# EAGLE design OnOnfre_DevBoard (EAGLE 9.1.3)
CNAME: BH ONOFRE; CREVISION: 5.1; DESIGNER: BrunoHorta
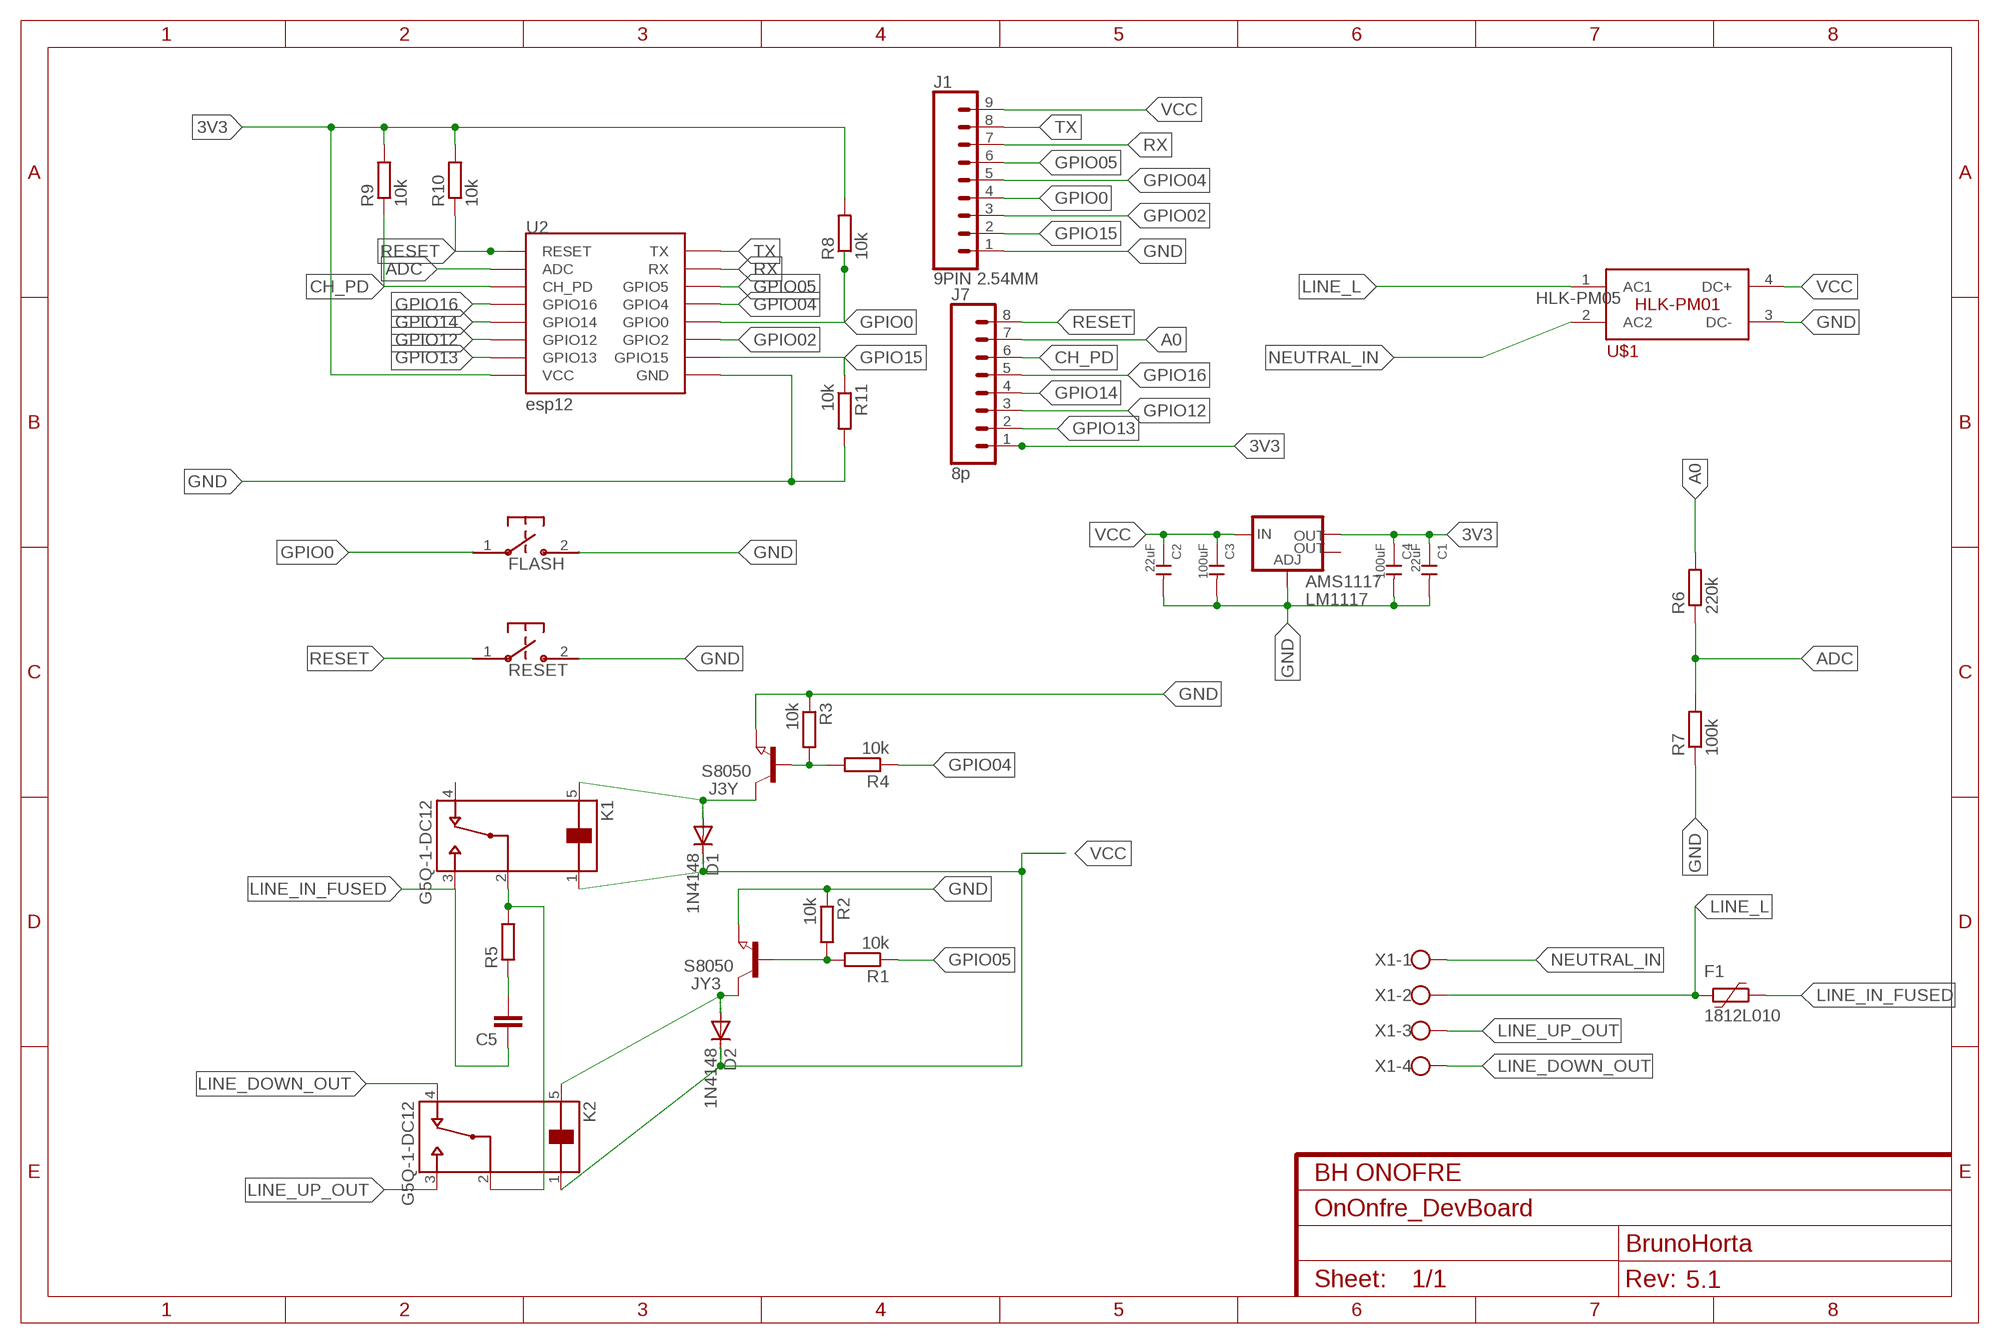
[diagram p0: schematic, sheet 1]

## Parts
AMS1117  LM1117  V_REG_LM1117SOT223  [SOT223]
C1  22uF  CERAMIC-1NF-1KV-10%-X7R(1206)  [C1206]
C2  22uF  CERAMIC-1NF-1KV-10%-X7R(1206)  [C1206]
C3  100uF  CERAMIC-1NF-1KV-10%-X7R(1206)  [C1206]
C4  100uF  CERAMIC-1NF-1KV-10%-X7R(1206)  [C1206]
C5  C-EU102-043X133  [C102-043X133]
D1  1N4148  DIODE-SOD80C  [SOD80C]
D2  1N4148  DIODE-SOD80C  [SOD80C]
F1  1812L010  [1812L]
FLASH  B3U-1000P-2P-SMD  B3U-1000P  [B3U-1000P]
J1  9PIN 2.54MM  CONN_09  [1X09]
J3Y  S8050  NPN-TRANSISTOR_SOT23  [SOT23]
J7  8p  CONN_08"  [1X08]
JY3  S8050  NPN-TRANSISTOR_SOT23  [SOT23]
K1  G5Q-1-DC12  [RELAY_G5Q-1-DC12]
K2  G5Q-1-DC12  [RELAY_G5Q-1-DC12]
R1  10k  R-EU_R0603  [R0603]
R2  10k  R-EU_R0603  [R0603]
R3  10k  R-EU_R0603  [R0603]
R4  10k  R-EU_R0603  [R0603]
R5  R-EU_R2512  [R2512]
R6  220k  R-EU_R0603  [R0603]
R7  100k  R-EU_R0603  [R0603]
R8  10k  R-EU_R0603  [R0603]
R9  10k  R-EU_R0603  [R0603]
R10  10k  R-EU_R0603  [R0603]
R11  10k  R-EU_R0603  [R0603]
RESET  B3U-1000P-2P-SMD  B3U-1000P  [B3U-1000P]
U2  esp12  ESP12SMD  [ESP12-SMD]
U$1  HLK-PM01  [HLK-PM01]
X1  W237-4  [W237-4]

## Nets
3V3: AMS1117.2(OUT) C1.1 C4.1 J7.1 R8.2 R9.2 R10.2 U2.VCC
A0: J7.7 R6.2
ADC: R6.1 R7.2 U2.ADC
CH_PD: J7.6 R9.1 U2.CH_PD
GND: AMS1117.1(ADJ) C1.2 C2.2 C3.2 C4.2 FLASH.2 J1.1 J3Y.2(E) JY3.2(E) R2.1 R3.1 R7.1 R11.2 RESET.2 U2.GND U$1.3(DC-)
GPIO0: FLASH.1 J1.4 R8.1 U2.GPIO0
GPIO02: J1.3 U2.GPIO2
GPIO04: J1.5 R4.1 U2.GPIO4
GPIO05: J1.6 R1.1 U2.GPIO5
GPIO12: J7.3 U2.GPIO12
GPIO13: J7.2 U2.GPIO13
GPIO14: J7.4 U2.GPIO14
GPIO15: J1.2 R11.1 U2.GPIO15
GPIO16: J7.5 U2.GPIO16
LINE_DOWN_OUT [220V]: K2.4 X1.4
LINE_IN_FUSED [220V]: C5.1 F1.1 K1.3
LINE_L [220V]: F1.2 U$1.1(AC1) X1.2
LINE_UP_OUT [220V]: K2.3 X1.3
N$1: D1.A J3Y.3(C) K1.5
N$3: K1.2 K2.2 R5.2
N$4: C5.2 R5.1
N$7: J3Y.1(B) R3.2 R4.2
N$9: D2.A JY3.3(C) K2.5
N$13: JY3.1(B) R1.2 R2.2
NEUTRAL_IN [220V]: U$1.2(AC2) X1.1
RESET: J7.8 R10.1 RESET.1 U2.RESET
RX: J1.7 U2.RXD0(RX)
TX: J1.8 U2.TXD0(TX)
VCC: AMS1117.3(IN) C2.1 C3.1 D1.C D2.C J1.9 K1.1 K2.1 U$1.4(DC+)
Unconnected: AMS1117.4(OUT) K1.4

## Notes on the sheet
- HLK-PM05

## Library data of the parts
AMS1117 = SparkFun-IC-Power:V_REG_LM1117: Voltage Regulator LM1117 Standard adjustable voltage regulator but in SMD form. Spark Fun Electronics SKU : COM-00595; PROD_ID: VREG-08170
C1-C4 = Seeed-Capacitor:CERAMIC-1NF-1KV-10%-X7R?(1206): 302010189; MPN: CC1206KKX7RCBB102; VALUE: 1NF
C5 = rcl:C-EU: CAPACITOR, European symbol; SPICEPREFIX: C
D1 D2 = diode:DIODE-: DIODE
F1 = polyfuse-smd_10:?: Polyfuse Resettable PTC Source: http://www.littelfuse.com/products/resettable-ptcs.aspx; MF: Littelfuse; MPN: 1812L010; OC_FARNELL: 1822210; OC_NEWARK: 78R5551
FLASH RESET = switches:B3U: Switch; DIGIKEY: SW1020CT-ND; MANUFACTURER: Omron; MPN: B3U-1000P
J1 = SparkFun-Connectors:CONN_09: Multi connection point. Often used as Generic Header-pin footprint for 0.1 inch spaced/style header connections On any of the 0.1 inch spaced packages, you can populate with these: Break Away Headers - Straight <https://www.sparkfun.com/products/116> (PRT-00116) Break Away Male Headers - Right Angle <https://www.sparkfun.com/products/553> (PRT-00553) Female Headers <https://www.sparkfun.com/products/115> (PRT-00115) Break Away Headers - Machine Pin <https://www.sparkfun.com/products/117> (PRT-00117) Break Away Female Headers - Swiss Machine Pin <https://www.sparkfun.com/products/743> (PRT-00743) For SCREWTERMINALS and SPRING TERMINALS visit here: Screw Terimnals on SparkFun.com <https://www.sparkfun.com/search/results?term=Screw+Terminals> (5mm/3.5mm/2.54mm spacing) This device is also useful as a general connection point to wire up your design to another part of your project. Our various solder wires solder well into these plated through hole pads. Hook-Up Wire - Assortment (Stranded, 22 AWG) <https://www.sparkfun.com/products/11375> (PRT-11375) Hook-Up Wire - Assortment (Solid Core, 22 AWG) <https://www.sparkfun.com/products/11367> (PRT-11367) View the entire wire category on our website here <https://www.sparkfun.com/categories/141> Special notes: Molex polarized connector foot print use with SKU : PRT-08231 with associated crimp pins and housings. 1MM SMD Version SKU: PRT-10208 NOTES ON THE VARIANTS LOCK and LOCK_LONGPADS... This footprint was designed to help hold the alignment of a through-hole component (i.e. 6-pin header) while soldering it into place. You may notice that each hole has been shifted either up or down by 0.005 of an inch from it's more standard position (which is a perfectly straight line). This slight alteration caused the pins (the squares in the middle) to touch the edges of the holes. Because they are alternating, it causes a "brace" to hold the component in place. 0.005 has proven to be the perfect amount of "off-center" position when using our standard breakaway headers. Although looks a little odd when you look at the bare footprint, once you have a header in there, the alteration is very hard to notice. Also,if you push a header all the way into place, it is covered up entirely on the bottom side.
J3Y JY3 = semicon-smd-ipc:NPN-TRANSISTOR_: NPN TRANSISTOR
J7 = SparkFun-Connectors:CONN_08: Multi connection point. Often used as Generic Header-pin footprint for 0.1 inch spaced/style header connections On any of the 0.1 inch spaced packages, you can populate with these: Break Away Headers - Straight <https://www.sparkfun.com/products/116> (PRT-00116) Break Away Male Headers - Right Angle <https://www.sparkfun.com/products/553> (PRT-00553) Female Headers <https://www.sparkfun.com/products/115> (PRT-00115) Break Away Headers - Machine Pin <https://www.sparkfun.com/products/117> (PRT-00117) Break Away Female Headers - Swiss Machine Pin <https://www.sparkfun.com/products/743> (PRT-00743) Arduino Stackable Header - 8 Pin <https://www.sparkfun.com/products/9279> (PRT-09279) For SCREWTERMINALS and SPRING TERMINALS visit here: Screw Terimnals on SparkFun.com <https://www.sparkfun.com/search/results?term=Screw+Terminals> (5mm/3.5mm/2.54mm spacing) This device is also useful as a general connection point to wire up your design to another part of your project. Our various solder wires solder well into these plated through hole pads. Hook-Up Wire - Assortment (Stranded, 22 AWG) <https://www.sparkfun.com/products/11375> (PRT-11375) Hook-Up Wire - Assortment (Solid Core, 22 AWG) <https://www.sparkfun.com/products/11367> (PRT-11367) View the entire wire category on our website here <https://www.sparkfun.com/categories/141> Special notes: Molex polarized connector foot print use with SKU : PRT-08231 with associated crimp pins and housings. 1MM SMD Version SKU: PRT-10208 NOTES ON THE VARIANTS LOCK and LOCK_LONGPADS... This footprint was designed to help hold the alignment of a through-hole component (i.e. 6-pin header) while soldering it into place. You may notice that each hole has been shifted either up or down by 0.005 of an inch from it's more standard position (which is a perfectly straight line). This slight alteration caused the pins (the squares in the middle) to touch the edges of the holes. Because they are alternating, it causes a "brace" to hold the component in place. 0.005 has proven to be the perfect amount of "off-center" position when using our standard breakaway headers. Although looks a little odd when you look at the bare footprint, once you have a header in there, the alteration is very hard to notice. Also,if you push a header all the way into place, it is covered up entirely on the bottom side.; PROD_ID: CONN-08438
K1 K2 = G5Q-1-DC12:G5Q-1-DC12: Power Relay 12VDC 5(NO)A/3(NC)DCA/10(NO)A/3(NC)ACA SPDT (( 20.3mm 10.3mm 16.2mm)) Through Hole; AVAILABILITY: Unavailable; DESCRIPTION: Power Relay 12VDC 5_NO_A/3_NC_DCA/10_NO_A/3_NC_ACA SPDT __ 20.3mm 10.3mm 16.2mm__ Through Hole; MF: Omron; MP: G5Q-1-DC12; PACKAGE: None; PRICE: None
R1-R11 = resistor:R-EU_: RESISTOR, European symbol
U2 = esp8266modules:ESP12: ESP8266 Wifi module 12
U$1 = HLK-PM01:HLK-PM01; AVAILABILITY: Unavailable; MF: Hi-link; MP: hlk-pm01; PACKAGE: Package Analog Devices; PRICE: None
X1 = con-wago-500:W237-4: WAGO SCREW CLAMP; OC_FARNELL: unknown; OC_NEWARK: unknown

## Net classes
1 220V: width 1.27 mm, clearance 2 mm

## Board
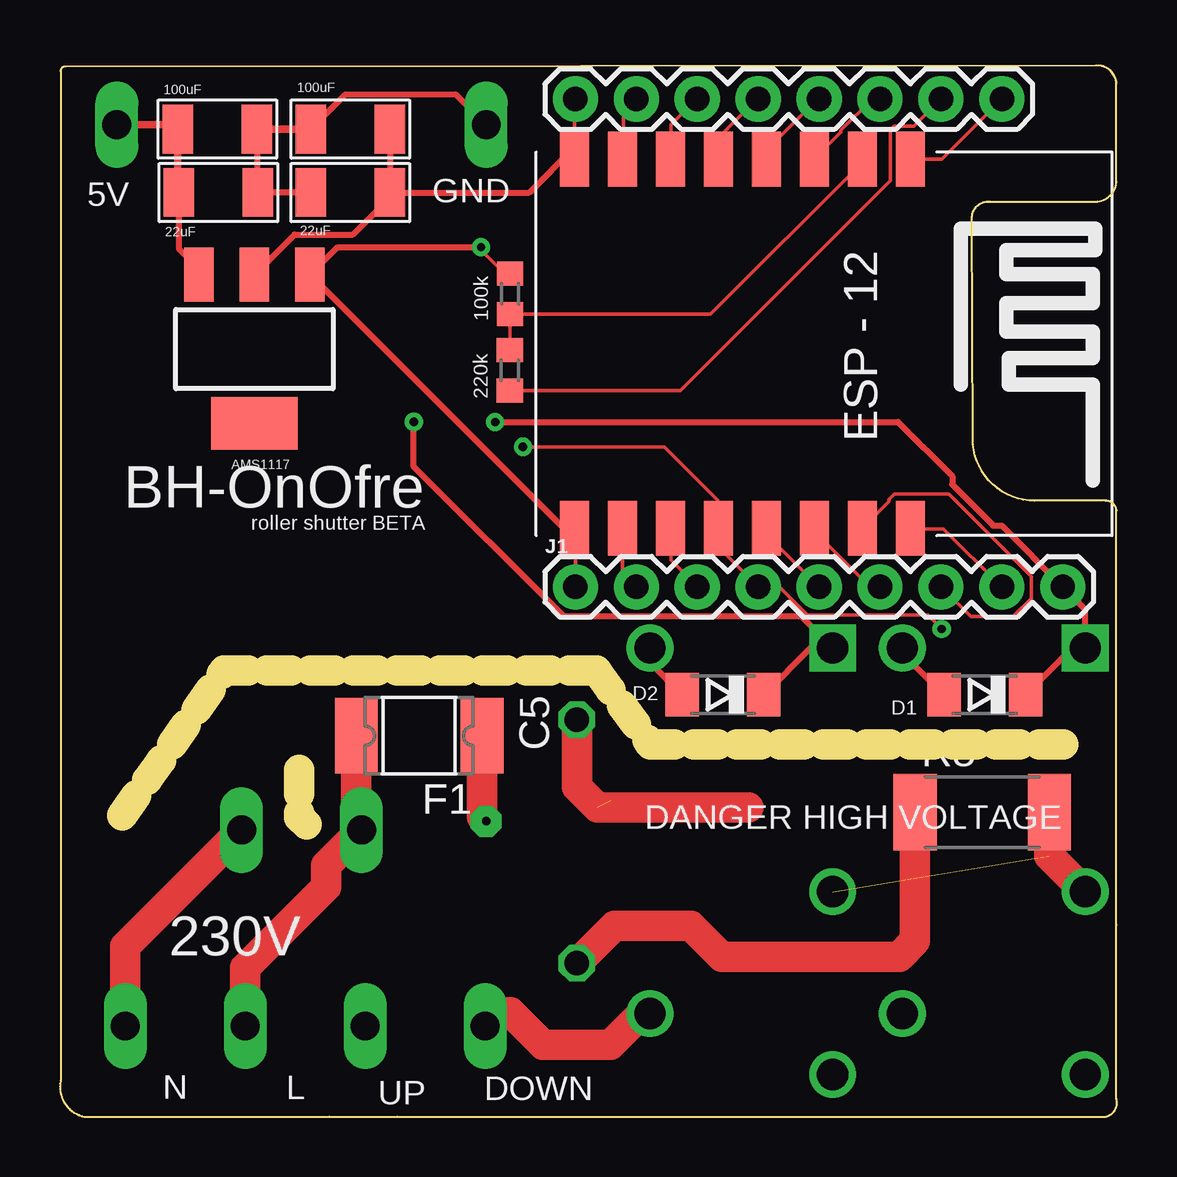
[diagram p1: board, top side]
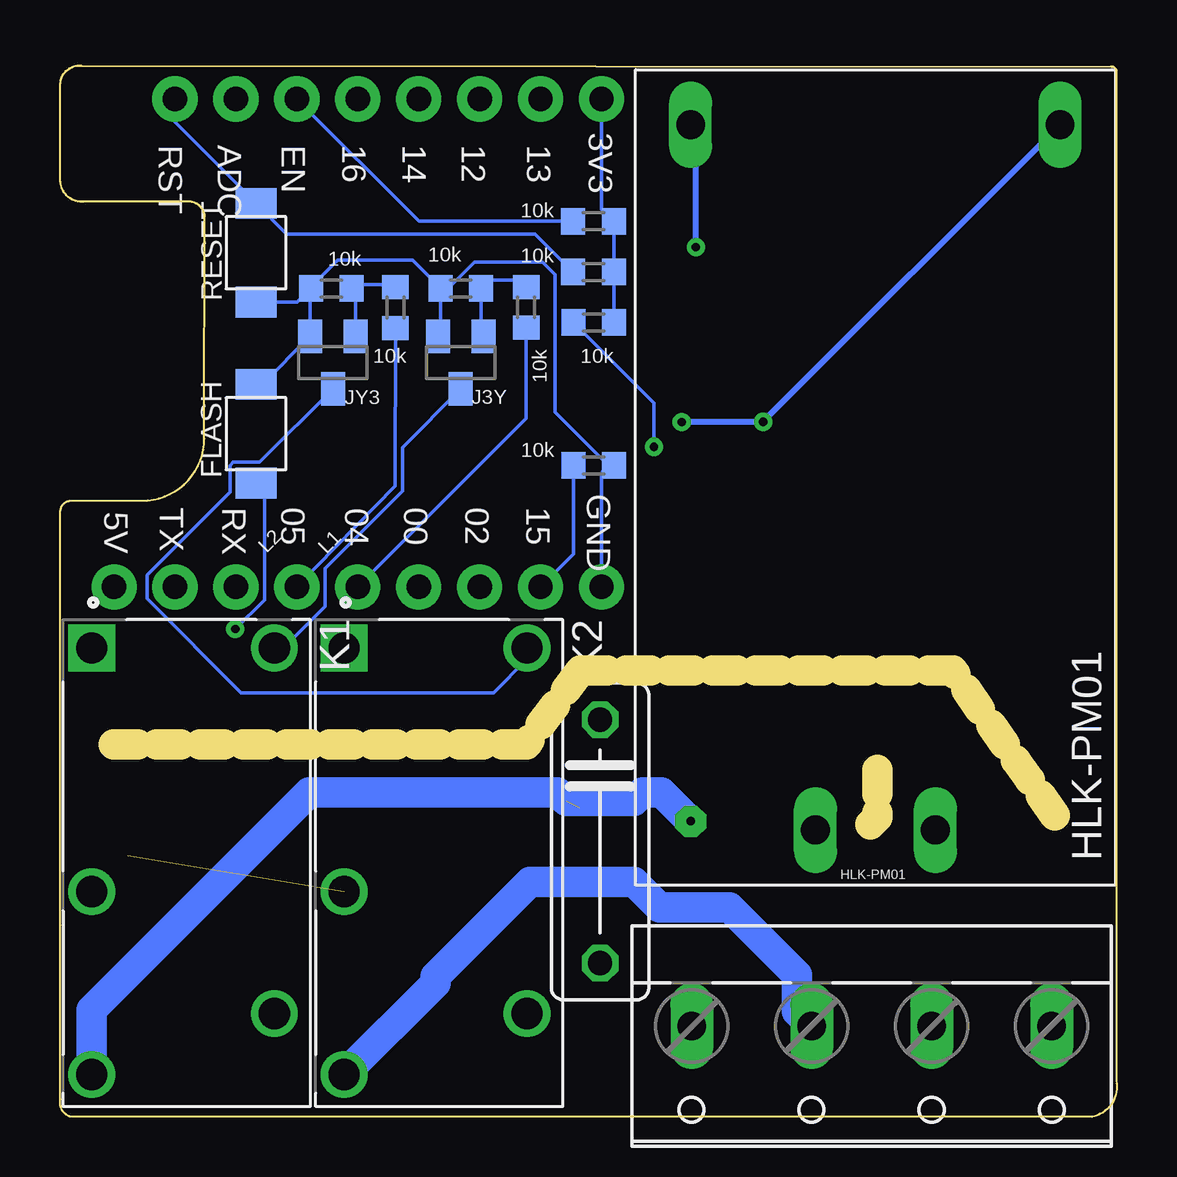
[diagram p2: board, bottom side, seen from below]

Size 44.06 x 43.82 mm. Coordinates in mm from the lower left corner, seen from the top.
Outline: 0.02,43.6 0.02,1.5 arc90 1.03,0 11.22,0 14.06,0.01 43.6,0 arc90 44.04,0.74 44.04,8 44.04,25.27 arc90 43.56,25.68 40.63,25.68 arc-90 38.04,28.27 38.02,37.53 arc-90 38.78,38.15 43.09,38.14 arc90 44.04,38.98 44.04,43.07 arc90 43.19,43.82 0.24,43.78 arc90 0.02,43.6
Copper layers (1*16): Top 0.035mm / dielectric 1.5mm / Bottom 0.035mm
Design rules "default": minimum track width 6mil, minimum drill 0.35mm, track to track 6mil, track to pad 6mil, pad to pad 6mil, via to via 6mil, smd to smd 6mil, copper to edge 40mil, drill to drill 6mil, minimum pad ring 10mil, minimum via ring 8mil, stop-mask expansion 4mil, vias tented up to drill 0mil, thermal gap 10mil
Milling: 30 lines

### Footprints (pad centres in the part's own frame; a part is rotated, then mirrored left to right if it is on the bottom)
SOT223 = smd 1.219 x 2.235: 1 -2.311,-3.099; 2 0,-3.099; 3 2.311,-3.099 | smd 3.6 x 2.2: 4 0,3.099
C1206 = smd 1.27 x 2.032: 1 -1.651,0; 2 1.651,0
C102-043X133 = drill 1.016 octagon: 1 -5.08,0; 2 5.08,0
SOD80C = smd 1.4 x 1.8: A 1.7,0; C -1.7,0
1812L = smd 1.78 x 3.15: 1 -2.62,0; 2 2.62,0
B3U-1000P = smd 1.283 x 1.7: 1 -2.056,0; 2 2.056,0
1X09 = drill 1.016 pad 1.88: 1 0,0; 2 2.54,0; 3 5.08,0; 4 7.62,0; 5 10.16,0; 6 12.7,0; 7 15.24,0; 8 17.78,0; 9 20.32,0
SOT23 = smd 1 x 1.4: 1 -0.95,-1.1; 2 0.95,-1.1; 3 0,1.1
1X08 = drill 1.016 pad 1.88: 1 0,0; 2 2.54,0; 3 5.08,0; 4 7.62,0; 5 10.16,0; 6 12.7,0; 7 15.24,0; 8 17.78,0
RELAY_G5Q-1-DC12 = drill 1.3 square: 1 -8.97,-3.96 | drill 1.3: 2 1.19,-3.96; 3 8.81,-3.96; 4 6.27,3.66; 5 -8.97,3.66
R0603 = smd 1 x 1.1: 1 -0.85,0; 2 0.85,0
R2512 = smd 1.8 x 3.2: 1 -2.8,0; 2 2.8,0
ESP12-SMD = smd 2.286 x 1.2: ADC -7.792,3.8; CH_PD -7.792,1.8; GND 7.592,-8.2; GPIO0 7.592,-2.2; GPIO2 7.592,-4.2; GPIO4 7.592,-0.2; GPIO5 7.592,1.8; GPIO12 -7.792,-4.2; GPIO13 -7.792,-6.2; GPIO14 -7.792,-2.2; GPIO15 7.592,-6.2; GPIO16 -7.792,-0.2; RESET -7.792,5.8; RXD0 7.592,3.8; TXD0 7.592,5.8; VCC -7.792,-8.2
HLK-PM01 = drill 1.2 long: 1 -14.7,2.5; 2 -14.7,-2.5; 3 14.7,7.7; 4 14.7,-7.7
W237-4 = drill 1.194 long: 1 -7.5,-1.27; 2 -2.5,-1.27; 3 2.5,-1.27; 4 7.5,-1.27

### Placement (x,y rotation side)
AMS1117  8.11,32 180 top
C1  12.1,38.53 180 top
C2  6.6,38.53 0 top
C3  6.56,41.17 0 top
C4  12.1,41.17 180 top
C5  21.55,11.48 270 bottom
D1  38.55,17.59 180 top
D2  27.64,17.59 180 top
F1  14.97,15.88 180 top
FLASH  35.89,28.48 90 bottom
J1  21.48,22.09 0 top
J3Y  27.35,31.44 180 bottom
J7  21.48,42.43 0 top
JY3  32.68,31.44 180 bottom
K1  38.78,10.57 270 bottom
K2  28.25,10.57 270 bottom
R1  30.08,33.73 90 bottom
R2  32.75,34.53 0 bottom
R3  27.35,34.53 0 bottom
R4  24.62,33.74 90 bottom
R5  38.44,12.69 0 top
R6  18.75,31.11 270 top
R7  18.76,34.3 270 top
R8  21.81,33.11 0 bottom
R9  21.82,37.33 0 bottom
R10  21.82,35.22 0 bottom
R11  21.81,27.15 0 bottom
RESET  35.89,36.02 270 bottom
U2  29.65,32.12 270 top
U$1  10.07,26.65 90 bottom
X1  10.22,2.51 180 bottom

### Tracks (layer width: path | path; a pad name or v marks a point on that pad's centre or on a via)
3V3
  Top 0.152: U2.VCC 21.45,40.41 21.45,42.39 J7.1 | 13.74,39.12 13.74,38.67 C1.1 13.75,38.7 13.74,39.12
  Top 0.254: C4.1 13.75,38.7 | C1.1 13.97,38.53 | 13.97,38.53 19.57,38.53 21.45,40.41 | AMS1117.2 9.78,36.77 12.21,36.77 13.97,38.53
  Bottom 0.152: R8.2 R10.2 20.97,37.32 | 20.97,37.32 R9.2 | R9.2 | J7.1 21.48,37.84 20.97,37.32
A0
  Top 0.152: J7.7 35.58,41.28 34.75,41.28 34.62,41.15 34.62,39.02 25.86,30.26 R6.2
ADC
  Top 0.152: U2.ADC 33.45,39.78 27.12,33.45 R7.2 R6.1
CH_PD
  Top 0.152: U2.CH_PD 31.49,39.97 32.56,41.04 32.56,41.12 33.86,42.41 34.16,42.41 J7.6
  Bottom 0.152: R9.1 29.09,37.33 J7.6
GND  (via drill 0.35)
  Top 0.152: U2.GND arc-90 21.48,24.49 21.48,23.68 J1.1 | R7.1 18.52,35.15 17.43,36.25
  Top 0.254: C4.2 11.9,42.62 16.39,42.62 16.5,42.62 U$1.3 | C3.2 8.21,38.57 C2.2 C1.2 | v17.55,36.25 17.43,36.25 11.56,36.25 AMS1117.1 21.48,24.04 21.48,23.68
  Top 0.305: C3.2 C4.2
  Bottom 0.152: R2.1 33.63,34.56 JY3.2 35.64,30.53 FLASH.2 | J1.1 21.48,26.72 arc90 R11.2 21.21,27.17 23.42,29.38 23.42,35.1 23.95,35.63 26.77,35.63 27.84,34.56 28.14,34.56 R3.1 | R3.1 28.2,32.64 J3Y.2 | R3.1 28.22,34.56 29.36,35.71 32.49,35.71 33.55,34.64 R2.1 | RESET.2 34.16,33.96 R2.1
  Bottom 0.254: v17.55,36.25 17.55,41.14 U$1.3
GPIO0  (via drill 0.35)
  Top 0.152: v36.75,20.34 36.66,20.42 36.66,20.44 36.18,20.92 31.16,20.92 29.99,22.09 J1.4 27.45,23.75 27.45,24.14 | 27.45,24.14 U2.GPIO0 | v19.3,27.93 25.2,27.93 27.42,25.7 27.42,24.17 27.45,24.14
  Bottom 0.152: FLASH.1 35.53,26.41 35.53,21.55 v36.75,20.34 | R8.1 19.3,29.75 v19.3,27.93
GPIO02
  Top 0.152: U2.GPIO2 25.48,24.51 25.48,23.21 26.54,22.14 J1.3
GPIO04
  Top 0.152: U2.GPIO4 29.51,24.51 29.51,24.2 31.57,22.14 J1.5
  Bottom 0.152: R4.1 24.63,29.1 J1.5
GPIO05
  Top 0.152: U2.GPIO5 31.49,24.51 31.49,24.35 33.7,22.14 34.16,22.14 J1.6
  Bottom 0.152: R1.1 30.1,26.3 J1.6
GPIO12
  Top 0.152: U2.GPIO12 25.48,39.97 25.48,41.35 26.54,42.41 J7.3
GPIO13
  Top 0.152: U2.GPIO13 23.49,39.97 23.49,41.96 23.95,42.41 J7.2
GPIO14
  Top 0.152: U2.GPIO14 27.46,39.97 27.46,40.81 29.06,42.41 J7.4
GPIO15
  Top 0.152: U2.GPIO15 23.45,22.67 J1.2
  Bottom 0.152: R11.1 22.66,23.46 J1.2
GPIO16
  Top 0.152: U2.GPIO16 29.51,39.97 29.51,40.36 31.57,42.41 J7.5
LINE_DOWN_OUT
  Top 1.27: X1.4 18.3,4.36 18.78,4.36 20.14,3 22.95,3 24.26,4.3 K2.4
LINE_IN_FUSED  (via drill 0.35 pad 1.3)  (1 unrouted)
  Top 1.27: v17.77,12.32 17.59,12.49 F1.1 | 28.7,12.9 22.4,12.9 21.55,13.75 C5.1
  Bottom 1.27: K1.3 42.74,4.46 33.67,13.53 23.32,13.53 22.95,13.16 20.14,13.16 19.77,13.53 18.98,13.53 v17.77,12.32
LINE_L
  Top 1.27: X1.2 7.72,6.21 11.1,9.59 11.1,10.49 U$1.1 12.35,12.17 F1.2
LINE_UP_OUT
  Bottom 1.27: X1.3 13.35,4.4 13.35,5.92 16.15,8.73 19.07,8.73 20.14,9.8 24.47,9.8 28.41,5.85 28.41,5.56 K2.3
N$1
  Top 0.254: D1.A 35.12,19.32 K1.5
  Bottom 0.152: J3Y.3 29.78,27.9 29.78,26.08 33,22.86 33,21.28 34.74,19.54 K1.5
N$3  (1 unrouted)
  Top 1.27: K1.2 41.24,10.88 R5.2
N$4
  Top 1.27: C5.2 23.11,7.97 26.3,7.97 27.59,6.68 34.98,6.68 35.64,7.34 R5.1
N$7
  Bottom 0.152: J3Y.1 26.5,32.63 R3.2 26.47,34.56 26.16,34.87 24.64,34.87 R4.2
N$9
  Top 0.254: D2.A 24.59,18.94 K2.5
  Bottom 0.152: JY3.3 35.73,27.29 36.83,27.29 36.96,27.16 36.96,26.04 40.43,22.57 40.43,21.61 36.5,17.68 25.99,17.68 24.59,19.08 K2.5
N$13
  Bottom 0.152: JY3.1 31.73,34.42 R2.2 31.72,34.49 31.68,34.7 30.46,34.7 R1.2
NEUTRAL_IN
  Top 1.27: U$1.2 2.72,7.11 X1.1
RESET
  Top 0.152: U2.RESET 36.75,39.91 J7.8
  Bottom 0.152: R10.1 24.25,36.8 34.61,36.8 RESET.1 39.26,41.45 J7.8
RX
  Top 0.152: U2.RXD0 33.48,24.58 34.54,25.65 34.54,25.72 34.77,25.95 37.06,25.95 40.49,22.52 40.49,21.61 39.72,20.85 37.97,20.85 36.75,22.07 J1.7
TX
  Top 0.152: U2.TXD0 35.46,24.51 36.83,24.51 39.19,22.14 J1.8
VCC  (via drill 0.35)
  Top 0.152: AMS1117.3 5.79,35.34 5.75,35.39 | C3.1 4.9,41.48 C3.1
  Top 0.254: C2.1 4.95,36.19 5.75,35.39 | v18.14,28.96 34.93,28.96 37.19,26.71 37.19,26.36 38.91,24.64 39.25,24.64 J1.9 42.74,21.15 K1.1 42.2,19.54 D1.C | v14.75,28.97 14.75,27.1 20.98,20.87 30.88,20.87 K2.1 31.29,19.54 D2.C
  Top 0.305: U$1.4 4.6,41.35 C3.1 4.91,38.57 C2.1
  Bottom 0.254: U$1.4 v14.75,28.97 14.76,28.96 v18.14,28.96

### Text on the board
tNames: 5V | GND | BH-OnOfre | roller shutter BETA | DANGER HIGH VOLTAGE | 230V | UP | N | L | DOWN
bNames: 3V3 | 13 | 12 | 14 | 16 | EN | ADC | RST | GND | 15 | 02 | 00 | 04 | 05 | RX | TX | 5V | L1 | L2 | HLK-PM01